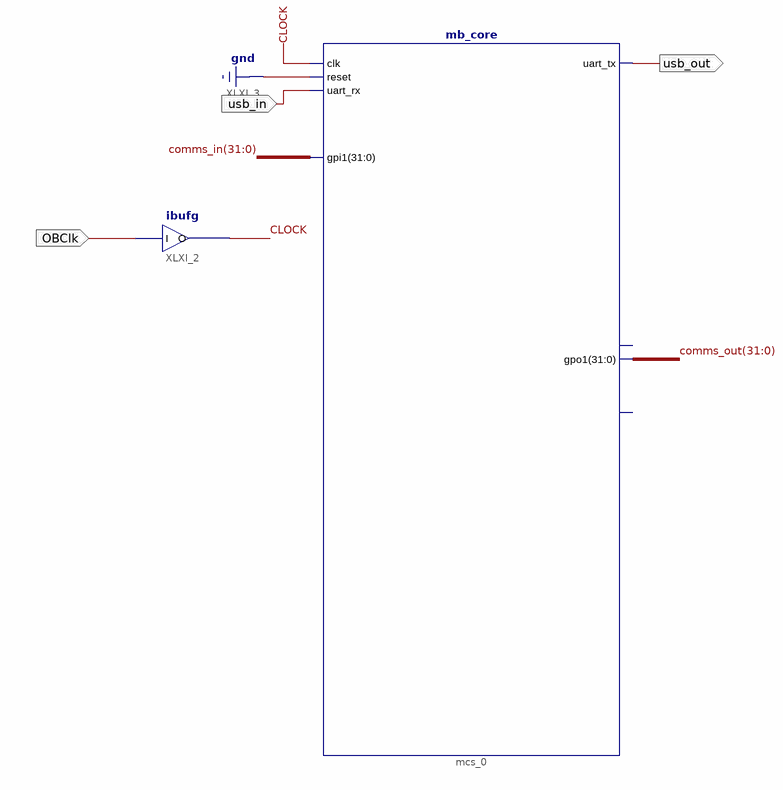
[diagram p0: schematic sheet 1]
// Xilinx ISE schematic test.sch (artix7) as structural Verilog: 2 symbols, 3 ports
module test (
  input  usb_in,
  input  OBClk,
  output usb_out
);

  wire CLOCK;
  wire [31:0] comms_in, comms_out;

  mb_core mcs_0 (
    .clk(CLOCK), .reset(1'b0), .uart_tx(usb_out), .uart_rx(usb_in), .gpi1(comms_in), .gpo1(comms_out));  // open: uart_interrupt, intc_irq
  ibufg XLXI_2 (.I(OBClk), .O(CLOCK));
endmodule
